# Altium schematic sheet Peripherals.SchDoc
size Letter
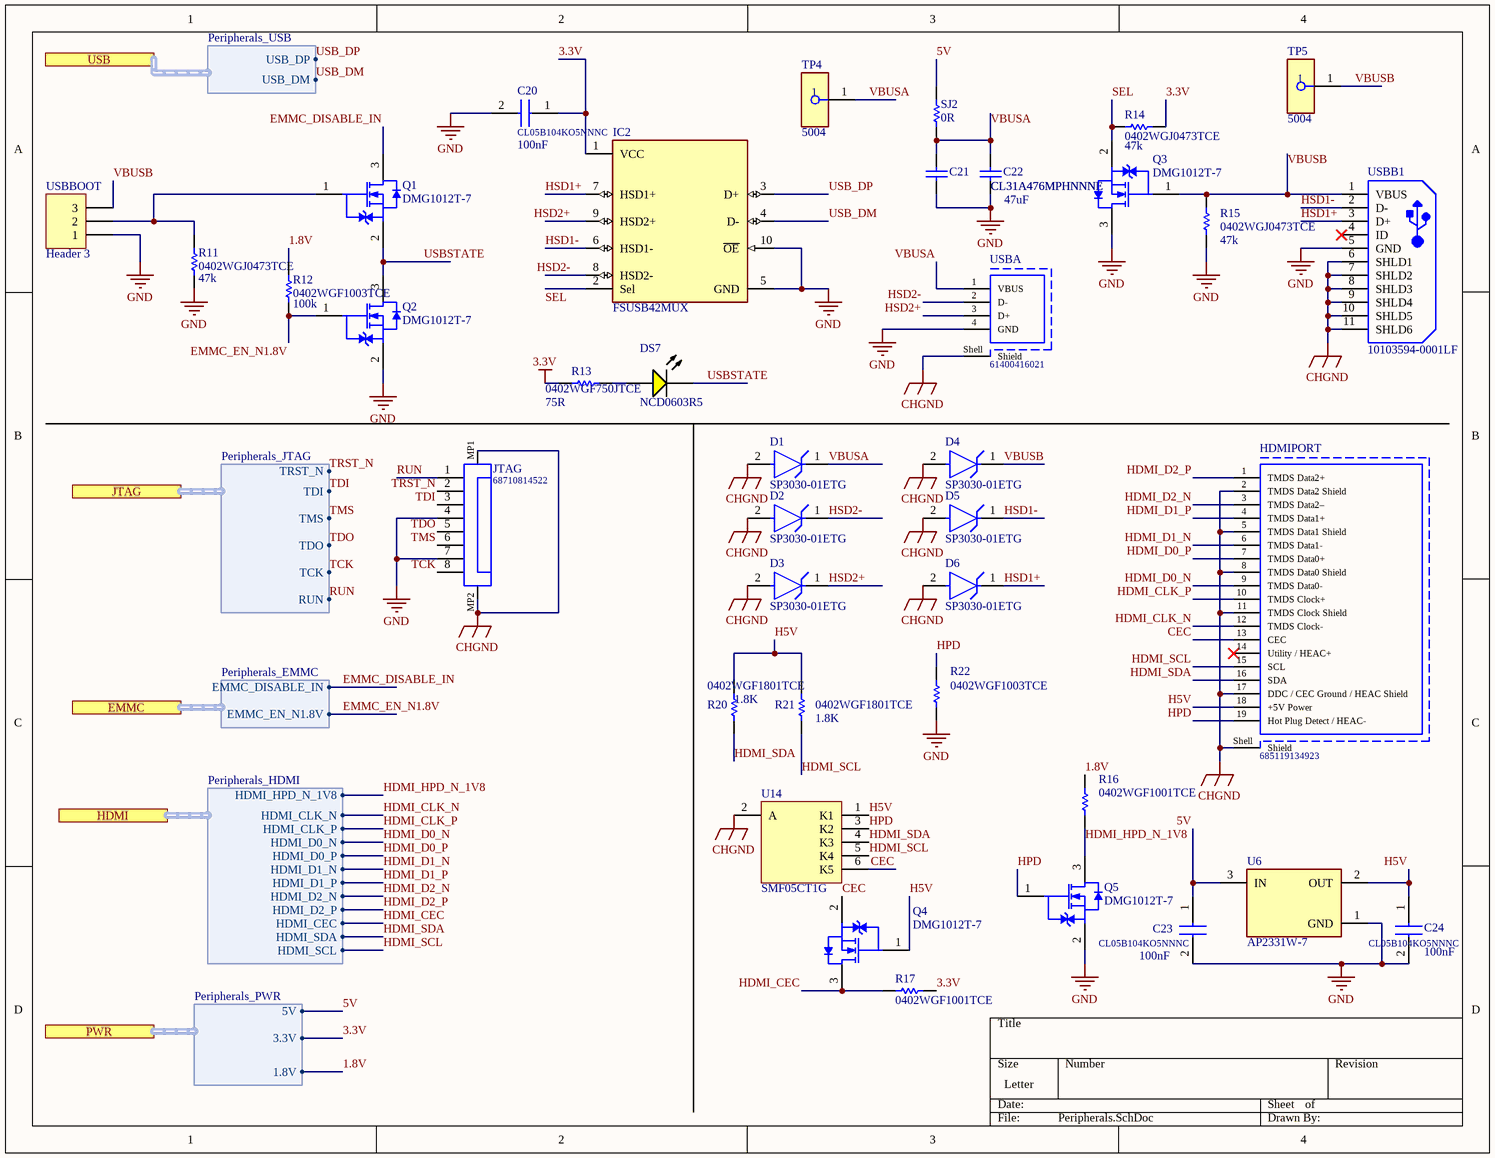
[diagram p0: Peripherals.SchDoc]

## Parts
C20  CL05B104KO5NNNC  value 100nF  [CAPC1005X55N]
C21  CL31A476MPHNNNE  [C1206]
C22  CL31A476MPHNNNE  [C1206]
C23  CL05B104KO5NNNC  value 100nF  [CAPC1005X55N]
C24  CL05B104KO5NNNC  value 100nF  [CAPC1005X55N]
D1  SP3030-01ETG  [FP-SP3030-MFG]
D2  SP3030-01ETG  [FP-SP3030-MFG]
D3  SP3030-01ETG  [FP-SP3030-MFG]
D4  SP3030-01ETG  [FP-SP3030-MFG]
D5  SP3030-01ETG  [FP-SP3030-MFG]
D6  SP3030-01ETG  [FP-SP3030-MFG]
DS7  NCD0603R5  [AVAG-HSMX-C190_V]
HDMIPORT  685119134923  [685119134923]
IC2  FSUSB42MUX  [FP-846AP-MFG]
JTAG  68710814522  [68710814522]
Q1  DMG1012T-7  [DIOD-SOT523-3_V]
Q2  DMG1012T-7  [DIOD-SOT523-3_V]
Q3  DMG1012T-7  [DIOD-SOT523-3_V]
Q4  DMG1012T-7  [DIOD-SOT523-3_V]
Q5  DMG1012T-7  [DIOD-SOT523-3_V]
R11  0402WGJ0473TCE  [0402-A]
R12  0402WGF1003TCE  [0402]
R13  0402WGF750JTCE  spec: 75R  [RESC1005X40X25ML05T10]
R14  0402WGJ0473TCE  [0402-A]
R15  0402WGJ0473TCE  [0402-A]
R16  0402WGF1001TCE  [0402]
R17  0402WGF1001TCE  [0402]
R20  0402WGF1801TCE  value 1.8K  [0402]
R21  0402WGF1801TCE  value 1.8K  [0402]
R22  0402WGF1003TCE  [0402]
SJ2  0R  [J1-0603]
TP4  5004  [FP-5004-MFG]
TP5  5004  [FP-5004-MFG]
U6  AP2331W-7  [FP-SC59-IPC_B]
U14  SMF05CT1G  [ONSC-SC70-6-419B-02_W_V]
USBA  61400416021  [61400416021]
USBB1  10103594-0001LF  [FCI-10103594-0001LF_V]
USBBOOT  Header 3  [HDR1X3]

## Ports
EMMC (harness Peripherals_EMMC), HDMI (harness Peripherals_HDMI), JTAG (harness Peripherals_JTAG), PWR (harness Peripherals_PWR), USB (harness Peripherals_USB)

## Harnesses
Peripherals_USB: USB_DP, USB_DM
Peripherals_HDMI: HDMI_HPD_N_1V8, HDMI_CLK_N, HDMI_CLK_P, HDMI_D0_N, HDMI_D0_P, HDMI_D1_N, HDMI_D1_P, HDMI_D2_N, HDMI_D2_P, HDMI_CEC, HDMI_SDA, HDMI_SCL
Peripherals_JTAG: TRST_N, TDI, TMS, TDO, TCK, RUN
Peripherals_PWR: 5V, 3.3V, 1.8V
Peripherals_EMMC: EMMC_DISABLE_IN, EMMC_EN_N1.8V

## Nets
3.3V: C20.1 IC2.1(VCC) R13.2 R14.1 R17.2 ; port PWR.3.3V
CHGND: D1.2(A) D2.2(A) D3.2(A) D4.2(A) D5.2(A) D6.2(A) HDMIPORT.2(TMDS_Data2_Shield) HDMIPORT.5(TMDS_Data1_Shield) HDMIPORT.8(TMDS_Data0_Shield) HDMIPORT.11(TMDS_Clock_Shield) HDMIPORT.17(DDC_/_CEC_Ground_/_HEAC_Shield) HDMIPORT.Shell(Shield) JTAG.MP1 JTAG.MP2 U14.2(A) USBA.Shell(Shield) USBB1.6(SHLD1) USBB1.7(SHLD2) USBB1.8(SHLD3) USBB1.9(SHLD4) USBB1.10(SHLD5) USBB1.11(SHLD6)
GND: C20.2 C21.1 C22.1 C23.2 C24.2 IC2.5(GND) IC2.10(~{OE}) JTAG.4 JTAG.7 Q2.2(S) Q3.3(D) Q5.2(S) R11.1 R15.1 R22.2 U6.1(GND) USBA.4(GND) USBB1.5(GND) USBBOOT.1
1.8V: R12.2 R16.1 ; port PWR.1.8V
5V: C23.1 SJ2.2 U6.3(IN) ; port PWR.5V
CEC: HDMIPORT.13(CEC) Q4.2(S) U14.6(K5)
EMMC_DISABLE_IN: Q1.3(D) ; port EMMC.EMMC_DISABLE_IN
EMMC_EN_N1.8V: Q2.1(G) R12.1 ; port EMMC.EMMC_EN_N1.8V
H5V: C24.1 HDMIPORT.18(+5V_Power) Q4.1(G) R20.2 R21.2 U6.2(OUT) U14.1(K1)
HDMI_CEC: Q4.3(D) R17.1 ; port HDMI.HDMI_CEC
HDMI_CLK_N: HDMIPORT.12(TMDS_Clock-) ; port HDMI.HDMI_CLK_N
HDMI_CLK_P: HDMIPORT.10(TMDS_Clock+) ; port HDMI.HDMI_CLK_P
HDMI_D0_N: HDMIPORT.9(TMDS_Data0-) ; port HDMI.HDMI_D0_N
HDMI_D0_P: HDMIPORT.7(TMDS_Data0+) ; port HDMI.HDMI_D0_P
HDMI_D1_N: HDMIPORT.6(TMDS_Data1-) ; port HDMI.HDMI_D1_N
HDMI_D1_P: HDMIPORT.4(TMDS_Data1+) ; port HDMI.HDMI_D1_P
HDMI_D2_N: HDMIPORT.3(TMDS_Data2–) ; port HDMI.HDMI_D2_N
HDMI_D2_P: HDMIPORT.1(TMDS_Data2+) ; port HDMI.HDMI_D2_P
HDMI_HPD_N_1V8: Q5.3(D) R16.2 ; port HDMI.HDMI_HPD_N_1V8
HDMI_SCL: HDMIPORT.15(SCL) R21.1 U14.5(K4) ; port HDMI.HDMI_SCL
HDMI_SDA: HDMIPORT.16(SDA) R20.1 U14.4(K3) ; port HDMI.HDMI_SDA
HPD: HDMIPORT.19(Hot_Plug_Detect_/_HEAC-) Q5.1(G) R22.1 U14.3(K2)
HSD1+: D6.1(C) IC2.7(HSD1+) USBB1.3(D+)
HSD1-: D5.1(C) IC2.6(HSD1-) USBB1.2(D-)
HSD2+: D3.1(C) IC2.9(HSD2+) USBA.3(D+)
HSD2-: D2.1(C) IC2.8(HSD2-) USBA.2(D-)
RUN: JTAG.1 ; port JTAG.RUN
SEL: IC2.2(Sel) Q3.2(S) R14.2
TCK: JTAG.8 ; port JTAG.TCK
TDI: JTAG.3 ; port JTAG.TDI
TDO: JTAG.5 ; port JTAG.TDO
TMS: JTAG.6 ; port JTAG.TMS
TRST_N: JTAG.2 ; port JTAG.TRST_N
USB_DM: IC2.4(D-) ; port USB.USB_DM
USB_DP: IC2.3(D+) ; port USB.USB_DP
USBSTATE: DS7.2(K) Q1.2(S) Q2.3(D)
VBUSA: C21.2 C22.2 D1.1(C) SJ2.1 TP4.1 USBA.1(VBUS)
VBUSB: D4.1(C) Q3.1(G) R15.2 TP5.1 USBB1.1(VBUS) USBBOOT.3
NetDS7_1: DS7.1(A) R13.1
NetQ1_1: Q1.1(G) R11.2 USBBOOT.2

Not connected (* = marked no-connect by the designer): HDMIPORT 14(Utility_/_HEAC+)*; USBB1 4(ID)*

## Notes on the sheet
- 47k
- (near C22) 47uF
- (near R11) 47k
- (near R15) 47k
- (near R12) 100k

## Library data of the parts
C20 C23 C24 = C0402C560K5RACTU: 100nF 0402; Manufacturer_Name: Kemet; Datasheet Link: https://content.kemet.com/datasheets/KEM_C1002_X7R_SMD.pdf; Height: 0.55mm; Manufacturer_Part_Number: C0402C560K5RACTU; Arrow Part Number: C0402C560K5RACTU; Mouser Part Number: 80-C0402C560K5RACTU; Mouser Price/Stock: https://www.mouser.co.uk/ProductDetail/KEMET/C0402C560K5RACTU?qs=gt1LBUVyoHmQZW5v3ySgNQ%3D%3D
C21 C22 = Cap: 47uF 1206; Published: 8-Jun-2000; LatestRevisionDate: 17-Jul-2002; LatestRevisionNote: Re-released for DXP Platform.; PackageReference: RAD-0.3; Publisher: Altium Limited; PackageDescription: Radial Cap, Thru-Hole; 2 Leads; 0.3 in Pin Spacing; Value: 47uF; LCSC Part #: C96123
D1-D6 = CMP-08607-000070-1: TVS DIODE 5V 10V SOD882; Manufacturer: Littelfuse; Max Junction Temp: +150°C; Automotive Grade: Grade 1; Direction: Unidirectional; Peak Pulse Current: 3A; Capacitance: 0.5pF; Value: 0.5pF; Number Of Channels: 1; Manufacturer Part Number: SP3030-01ETG; Temperature Range Low: -40°C; Lead Free: Yes; Package: SP3030; Device Class L2: TVS Diodes; Height: 0.6mm; ComponentLink2URL: https://www.littelfuse.com/~/media/electronics/datasheets/tvs_diode_arrays/littelfuse_tvs_diode_array_sp3030_datasheet.pdf.pdf; Device Class L3: unset; Category: Diode; Reverse Standoff Voltage: 5V; RoHS: TRUE; Digikey Description: TVS DIODE 5V 10V SOD882; Octopart: https://octopart.com/sp3030-01etg-littelfuse-29687287; ComponentLink2Description: Datasheet; Device Class L1: Circuit Protection; Automotive: Yes; Temperature: -40°C to +125°C; Temperature Range High: +125°C; Clamping Voltage: 10V; Mouser Description: TVS Diodes / ESD Suppressors 5V 1uA 22kV UNIDIRECTIONAL
DS7 = CMP-1744-00003-1: 0603 LIGHT EMITTING DIODES (LED) ROHS; Tolerance: 1%; Voltage Rating: 50 V; Power Rating: 100 mW; Case\Package: 0603; Resistance: 390 Ohm; Min Operating Temperature: -55 degC; Length: 1.6 mm; ComponentLink3Description: Package Specification; Mount: Surface Mount; PackageReference: HSMX-C190; ComponentLink2Description: Datasheet; DatasheetVersion: Mar-12; Case Code (Metric): 1608; Pins: 2; Package Quantity: 5000; ComponentLink2URL: http://docs.avagotech.com/docs/AV02-0551EN; ComponentLink1Description: Manufacturer URL; RoHSCompliant: true; Packaging: Tape and Reel; PackageDescription: 2-Pin Surface Mount Device, Body 1.6 x 0.8 mm, Height 0.9 mm; REACH SVHC: No SVHC; ComponentLink3URL: http://www.fairchildsemi.com/dwg/MA/MA03D.pdf; Voltage Rating (DC): 50 V; Width: 0.8 mm; ComponentLink1URL: http://www.avagotech.com/; Max Operating Temperature: 155 degC; Case Code (Imperial): 0603; Height: 0.45 mm
HDMIPORT = CMP-1502-00169-1: HDMI Type A Receptacle WR-HDMI, Horizontal, SMT; Manufacturer: Wurth Elektronik; Contact Resistance: 30mOhm; Working Voltage: 40VDC; Rated Current: 0.5A; Publisher: WurthElektronik; Datasheet URL: https://katalog.we-online.de/em/datasheet/685119134923.pdf; Gender: Receptacle; Manufacturer URL: http://www.we-online.de; Orientation: Horizontal; Mounting Technology: SMT; Part Number: 685119134923; Packaging: TapeandReel; Package Reference: 685119134923; Operating Temperature: -20to85degC; Connector Type: HDMITypeA; LCSC Part #: *
IC2 = CMP-07103-000004-1: IC USB SWITCH DPDT 10MSOP; Voltage: 4.3V; Current: 100mA; Number of Inputs: 2; Supply Type: Single; Number of Outputs: 4; Data Rate: 480Mbps; On-State Resistance: 6.5R; Min Supply Voltage: 3V; Package Quantity: 1; Length: 3mm; Radiation Hardening: No; Number of Pins: 10; Width: 3mm; Number of Channels: 2; REACH SVHC: No SVHC; Lead Free: Lead Free; Max Operating Temperature: 85°C; Min Operating Temperature: -40°C; Packaging: Tape and Reel; Throw Configuration: DPDT; Operating Supply Voltage: 4.3V; Max Supply Voltage: 4.3V; Mount: Surface Mount; Case/Package: MSOP; Weight: 0.1125g; Height: 0.85mm; LCSC Part #: C11355
JTAG = CMP-1502-01528-1: SMT ZIF Connectors WR-FPC, Horizontal, Bottom Contact, pitch 0.5 mm, 8 pins; Manufacturer: Wurth Elektronik; Contact Resistance: 20mOhm; Pitch: 0.5mm; Withstanding Voltage: 250VAC; Working Voltage: 50VAC; Pin Number: 8; Rated Current: 0.5A; Contact Design: BottomContact; Publisher: WurthElektronik; Orientation: Horizontal; Manufacturer URL: http://www.we-online.de; Part Number: 68710814522; Mounting Technology: SMT; Packaging: TapeandReel; Package Reference: 68710814522; Operating Temperature: -25to85degC; Datasheet URL: https://katalog.we-online.de/em/datasheet/68710814522.pdf
Q1-Q5 = CMP-2000-07450-1: N-Channel Enhancement Mode MOSFET, 20 V, 630 mA, -55 to 150 degC, 3-Pin SOT23, RoHS, Tape and Reel; Manufacturer: Diodes Inc; Continuous Drain Current (ID): 630mA; Number of Channels: 1; Drain to Source Voltage (Vdss): 20V; Gate to Source Voltage (Vgs): 6V; Turn-On Delay Time: 5.1ns; Rds On Max: 400mOhm; Power Dissipation: 280mW; Fall Time: 12.3ns; Input Capacitance: 60.67pF; Turn-Off Delay Time: 26.7ns; Rise Time: 7.4ns; Drain to Source Resistance: 300mOhm; Element Configuration: Single; Case\/Package: SOT-523; Threshold Voltage: 1V; Manufacturer URL: http://www.diodes.com/; Datasheet URL: https://www.diodes.com/assets/Datasheets/ds31783.pdf; Mount: SurfaceMount; Width: 0.85mm; REACH SVHC: NoSVHC; Datasheet Version: Rev. 3-2, 01/2012; Lead Free: LeadFree; Number of Pins: 3; Drain to Source Breakdown Voltage: 20V; Height: 0.8mm; Length: 1.7mm; Radiation Hardening: No; Packaging: TapeandReel; Contact Plating: Matte; Max Operating Temperature: 150degC; RoHSCompliant: true; Weight: 7.1E-05oz; Package Reference: SOT523-3; Package Quantity: 3000; Max Power Dissipation: 280mW; Package Description: 3-Pin Small Outline Transistor, Body 1.6 x 0.8 mm, Pitch 0.5 mm; On-State Resistance: 400MOhm; Min Operating Temperature: -55degC; Number of Elements: 1; Mounting Technology: SurfaceMount; LCSC Part #: C20512
R11 R14 R15 = Res1: 47k 0402; Published: 8-Jun-2000; LatestRevisionDate: 17-Jul-2002; LatestRevisionNote: Re-released for DXP Platform.; PackageReference: AXIAL-0.3; Publisher: Altium Limited; PackageDescription: Axial Device, Thru-Hole; 2 Leads; 0.3 in Pin Spacing; LCSC Part #: C25792
  R11: Value: 47K
  R14 R15: Value: 47k
R12 R22 = Res1: 100k 0402; Published: 8-Jun-2000; LatestRevisionDate: 17-Jul-2002; LatestRevisionNote: Re-released for DXP Platform.; PackageReference: AXIAL-0.3; Publisher: Altium Limited; PackageDescription: Axial Device, Thru-Hole; 2 Leads; 0.3 in Pin Spacing
R13 = CMP-2002-07344-1: 75R 0402; Part Number: RC0402FR-07100RL; Manufacturer: Yageo / Phycomp
R16 R17 = Res1: 1k 0402; Published: 8-Jun-2000; LatestRevisionDate: 17-Jul-2002; LatestRevisionNote: Re-released for DXP Platform.; PackageReference: AXIAL-0.3; Publisher: Altium Limited; PackageDescription: Axial Device, Thru-Hole; 2 Leads; 0.3 in Pin Spacing
R20 R21 = Res1: 1.8k 0402; Published: 8-Jun-2000; LatestRevisionDate: 17-Jul-2002; LatestRevisionNote: Re-released for DXP Platform.; PackageReference: AXIAL-0.3; Publisher: Altium Limited; PackageDescription: Axial Device, Thru-Hole; 2 Leads; 0.3 in Pin Spacing
SJ2 = Res1: Resistor; Published: 8-Jun-2000; LatestRevisionDate: 17-Jul-2002; LatestRevisionNote: Re-released for DXP Platform.; PackageReference: AXIAL-0.3; Publisher: Altium Limited; PackageDescription: Axial Device, Thru-Hole; 2 Leads; 0.3 in Pin Spacing; Value: 0R; LCSC Part #: C21189
TP4 TP5 = CMP-2000-05575-2: PC TEST POINT MINIATURE YELLOW; Manufacturer: Keystone; Number Of Contacts: 1; Is Female: yes; Device Class L1: Connectors; Manufacturer Part Number: 5004; Digikey Description: PC TEST POINT MINIATURE YELLOW; ComponentLink2URL: https://www.keyelco.com/product-pdf.cfm?p=1313; Lead Free: Yes; ComponentLink2Description: Datasheet; Category: Conn; Height: 4.72mm; Octopart: https://octopart.com/5004-keystone-28591; Mouser Description: TEST POINT PC MINI .040"D YELLOW; Device Class L3: unset; Contact Material: Silver; Package: 5004; Automotive: No; Device Class L2: unset; RoHS: TRUE
U6 = CMP-12752-000002-1: LOAD SWITCH SC59; Min Supply Voltage: 2.7V; Interface: On/Off; Turn-On Delay Time: 700us; Voltage: 5.2V; Current: 200mA; Output Configuration: High Side; Number of Outputs: 1; On-State Resistance: 350mR; Fault Protection: Over Temperature; Min Operating Temperature: -40°C; Number of Pins: 59; Max Operating Temperature: 85°C; Height: 1.3mm; Package Quantity: 3000; REACH SVHC: No SVHC; Radiation Hardening: No; Output Current: 200mA; Max Supply Voltage: 5.2V; Max Output Current: 200mA; Case/Package: TO-236-3; Width: 1.7mm; Mount: Surface Mount; Packaging: Tape and Reel; Length: 3.1mm; LCSC Part #: *
U14 = CMP-1061-00155-1: 5-Line Transient Voltage Suppressor Array, 6-Pin SC70, Pb-Free, Tape and Reel; Manufacturer: On Semiconductor; PPK Max (W): 100; Direction: Unidirectional; IR Max (uA): 5; PackageDescription: 6-Pin Small Outline Transistor, Body 2 x 1.25 mm, Pitch 0.65 mm; PackageReference: SC70-6-419B-02_W; ComponentLink2Description: Datasheet; Mounting Technology: Surface Mount; Packing: Tape and Reel; DatasheetVersion: Rev. 4; ComponentLink1Description: Manufacturer URL; ComponentLink2URL: http://www.onsemi.com/pub_link/Collateral/SMF05C-D.PDF; ComponentLink3Description: Package Specification; ComponentLink1URL: http://www.onsemi.com/; ComponentLink3URL: http://www.onsemi.com/pub_link/Collateral/SMF05C-D.PDF; PackageVersion: Rev. W; PartNumber: SMF05CT1G; RoHS: Pb-Free
USBA = CMP-1502-03227-1: USB 2.0 Type A Receptacle WR-COM, Horizontal, THT; Manufacturer: Wurth Elektronik; Working Voltage: 30VAC; Rated Current: 1.5A; Contact Resistance: 20mOhm; Manufacturer URL: http://www.we-online.de; Publisher: WurthElektronik; Packaging: Tray; Operating Temperature: -40to105degC; Orientation: Horizontal; Mounting Technology: THT; Part Number: 61400416021; Gender: Receptacle; Package Reference: 61400416021; Connector Type: USB2.0TypeA; Datasheet URL: https://katalog.we-online.de/em/datasheet/61400416021.pdf; LCSC Part #: *
USBB1 = CMP-1698-00007-1: Micro USB 2.0 B Receptacle, -55 to 85 degC, 5-Pin SMD, RoHS, Tape and Reel; Type (Resistor): Thick Film; Case\Package: 0603; Resistance: 4.7 kohm; Tolerance: 1%; Voltage Rating: 75 V; Power Rating: 100 mW; Case Code (Imperial): 0603; Case Code (Metric): 1608; REACH SVHC: Unknown; ComponentLink1URL: http://portal.fciconnect.com/; Package Quantity: 5000; RoHSCompliant: true; Max Operating Temperature: 155 degC; Min Operating Temperature: -55 degC; Mount: Surface Mount; Weight: 7.1E-05 oz; Length: 1.55 mm; PackageDescription: 5-Pin Surface Mount Device, Body 8.04 x 5.62 mm; Pins: 2; Height: 0.45 mm; ComponentLink2Description: Datasheet; ComponentLink2URL: http://portal.fciconnect.com/Comergent//fci/drawing/10103594.pdf; PackageReference: FCI-10103594-0001LF; DatasheetVersion: Rev. A, 06/2010; Width: 0.85 mm; Packaging: Tape and Reel; ComponentLink1Description: Manufacturer URL; LCSC Part #: *
USBBOOT = Header 3: Header, 3-Pin; LatestRevisionDate: 17-Jul-2002; LatestRevisionNote: Re-released for DXP Platform.; Publisher: Altium Limited